# Altium schematic sheet USB Outputs.SchDoc
size A; SheetNumber: 5; SheetTotal: 5
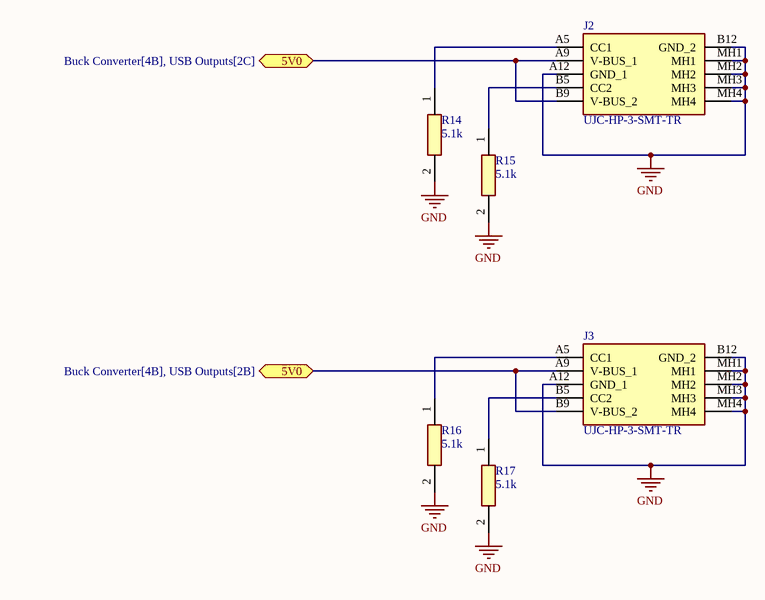
[diagram p0: USB Outputs.SchDoc]

## Parts
J2  UJC-HP-3-SMT-TR  [UJCHP3SMTTR]
J3  UJC-HP-3-SMT-TR  [UJCHP3SMTTR]
R14  5.1k  [RESC2012X60N]
R15  5.1k  [RESC2012X60N]
R16  5.1k  [RESC2012X60N]
R17  5.1k  [RESC2012X60N]

## Ports
5V0 (bidir, see Buck Converter[4B], USB Outputs[2B]), 5V0 (bidir, see Buck Converter[4B], USB Outputs[2C])

## Nets
GND: J2.A12(GND_1) J2.B12(GND_2) J2.MH1 J2.MH2 J2.MH3 J2.MH4 J3.A12(GND_1) J3.B12(GND_2) J3.MH1 J3.MH2 J3.MH3 J3.MH4 R14.2 R15.2 R16.2 R17.2
5V0: J2.A9(V-BUS_1) J2.B9(V-BUS_2) J3.A9(V-BUS_1) J3.B9(V-BUS_2) ; port 5V0
NetJ2_A5: J2.A5(CC1) R14.1
NetJ2_B5: J2.B5(CC2) R15.1
NetJ3_A5: J3.A5(CC1) R16.1
NetJ3_B5: J3.B5(CC2) R17.1

## Library data of the parts
J2 J3 = UJC-HP-3-SMT-TR: Connector; Manufacturer_Name: Same Sky; Datasheet Link: https://www.sameskydevices.com/product/resource/ujc-hp-3-smt-tr.pdf; Height: 3.36mm; Manufacturer_Part_Number: UJC-HP-3-SMT-TR; Mouser Part Number: 490-UJC-HP-3-SMT-TR; Mouser Price/Stock: https://www.mouser.co.uk/ProductDetail/Same-Sky/UJC-HP-3-SMT-TR?qs=vmHwEFxEFR%252BLRSV%252Bufrn1g%3D%3D; Arrow Part Number: UJC-HP-3-SMT-TR; Arrow Price/Stock: https://www.arrow.com/en/products/ujc-hp-3-smt-tr/cui-devices?utm_currency=USD&region=nac
R14-R17 = RC0805FR-075K1L: Resistor; Manufacturer_Name: YAGEO; Datasheet Link: https://www.yageo.com/upload/media/product/productsearch/datasheet/rchip/PYu-RC_Group_51_RoHS_L_12.pdf; Height: 0.6mm; Manufacturer_Part_Number: RC0805FR-075K1L; Mouser Part Number: 603-RC0805FR-075K1L; Mouser Price/Stock: https://www.mouser.co.uk/ProductDetail/YAGEO/RC0805FR-075K1L?qs=TvbiuNL4H85i1jCYhRJkKQ%3D%3D; Arrow Part Number: RC0805FR-075K1L; Arrow Price/Stock: https://www.arrow.com/en/products/rc0805fr-075k1l/yageo?region=nac